# Altium schematic sheet IOT_4G_BOARD.SchDoc
size A3; SheetNumber: 1; SheetTotal: 9
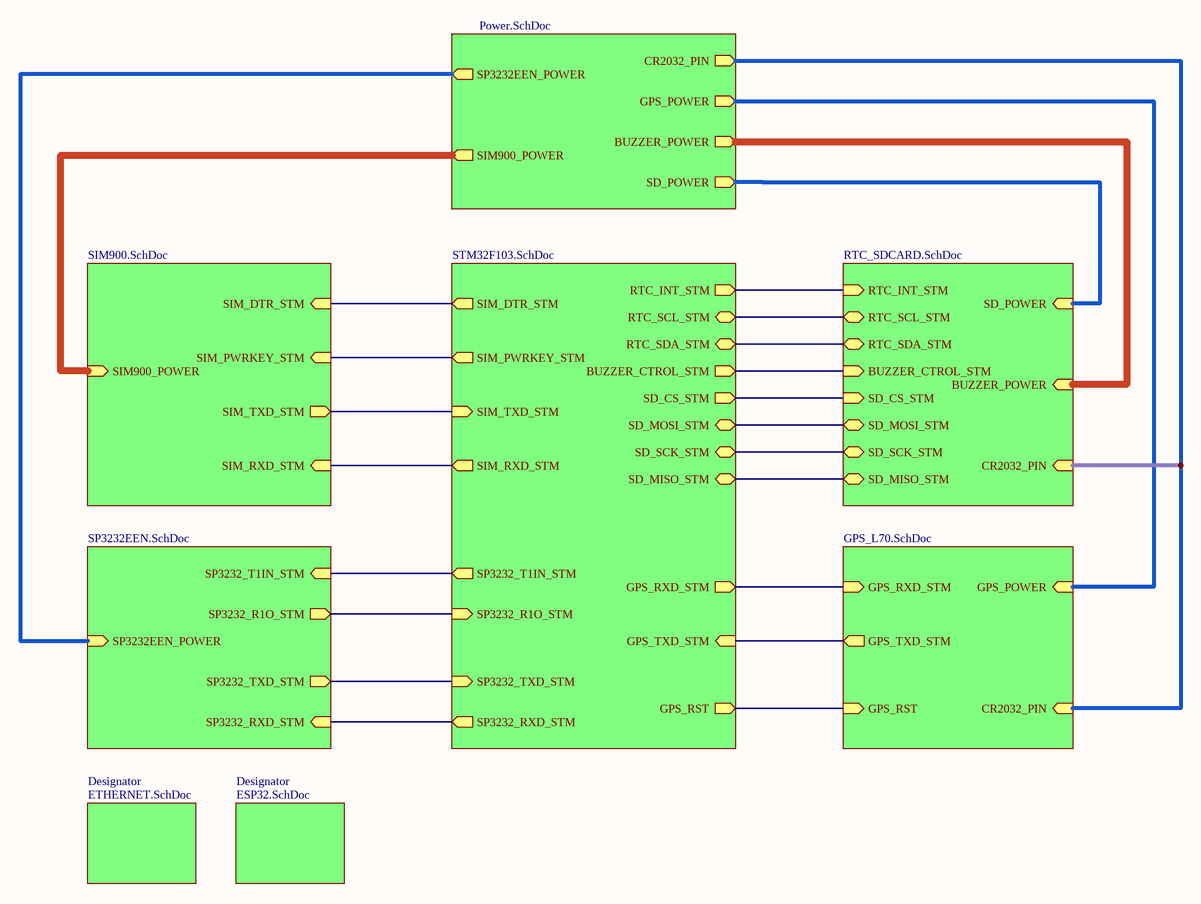
[diagram p0: IOT_4G_BOARD.SchDoc]

## Sub-sheets
Designator = SIM900.SchDoc: SIM900_POWER (in), SIM_RXD_STM (in), SIM_DTR_STM (in), SIM_TXD_STM (out), SIM_PWRKEY_STM (in)
Designator = SP3232EEN.SchDoc: SP3232EEN_POWER (in), SP3232_T1IN_STM (in), SP3232_R1O_STM (out), SP3232_TXD_STM (out), SP3232_RXD_STM (in)
Designator = STM32F103.SchDoc: SIM_RXD_STM (out), SIM_DTR_STM (out), SIM_TXD_STM (in), SP3232_T1IN_STM (out), SP3232_R1O_STM (in), SP3232_TXD_STM (in), SP3232_RXD_STM (out), RTC_SDA_STM (bidir), BUZZER_CTROL_STM (out), SD_CS_STM (out), SD_MOSI_STM (bidir), SD_SCK_STM (bidir), SD_MISO_STM (bidir), RTC_SCL_STM (bidir), RTC_INT_STM (out), GPS_RXD_STM (out), GPS_TXD_STM (in), GPS_RST (out), SIM_PWRKEY_STM (out)
Designator = RTC_SDCARD.SchDoc: CR2032_PIN (in), BUZZER_POWER (in), SD_POWER (in), RTC_SDA_STM (bidir), BUZZER_CTROL_STM (in), SD_CS_STM (in), SD_MOSI_STM (bidir), SD_SCK_STM (bidir), SD_MISO_STM (bidir), RTC_SCL_STM (bidir), RTC_INT_STM (in)
Designator = GPS_L70.SchDoc: GPS_POWER (in), CR2032_PIN (in), GPS_RXD_STM (in), GPS_TXD_STM (out), GPS_RST (in)
Designator = Power.SchDoc: CR2032_PIN (out), GPS_POWER (out), BUZZER_POWER (out), SD_POWER (out), SP3232EEN_POWER (out), SIM900_POWER (out)
Designator = ETHERNET.SchDoc: no entries
Designator = ESP32.SchDoc: no entries

## Nets
(unnamed): sheet Designator/SIM900_POWER, sheet Designator/SIM900_POWER
(unnamed): sheet Designator/SIM_RXD_STM, sheet Designator/SIM_RXD_STM
(unnamed): sheet Designator/SIM_DTR_STM, sheet Designator/SIM_DTR_STM
(unnamed): sheet Designator/SIM_TXD_STM, sheet Designator/SIM_TXD_STM
(unnamed): sheet Designator/SIM_PWRKEY_STM, sheet Designator/SIM_PWRKEY_STM
(unnamed): sheet Designator/SP3232EEN_POWER, sheet Designator/SP3232EEN_POWER
(unnamed): sheet Designator/SP3232_T1IN_STM, sheet Designator/SP3232_T1IN_STM
(unnamed): sheet Designator/SP3232_R1O_STM, sheet Designator/SP3232_R1O_STM
(unnamed): sheet Designator/SP3232_TXD_STM, sheet Designator/SP3232_TXD_STM
(unnamed): sheet Designator/SP3232_RXD_STM, sheet Designator/SP3232_RXD_STM
(unnamed): sheet Designator/RTC_SDA_STM, sheet Designator/RTC_SDA_STM
(unnamed): sheet Designator/BUZZER_CTROL_STM, sheet Designator/BUZZER_CTROL_STM
(unnamed): sheet Designator/SD_CS_STM, sheet Designator/SD_CS_STM
(unnamed): sheet Designator/SD_MOSI_STM, sheet Designator/SD_MOSI_STM
(unnamed): sheet Designator/SD_SCK_STM, sheet Designator/SD_SCK_STM
(unnamed): sheet Designator/SD_MISO_STM, sheet Designator/SD_MISO_STM
(unnamed): sheet Designator/RTC_SCL_STM, sheet Designator/RTC_SCL_STM
(unnamed): sheet Designator/RTC_INT_STM, sheet Designator/RTC_INT_STM
(unnamed): sheet Designator/GPS_RXD_STM, sheet Designator/GPS_RXD_STM
(unnamed): sheet Designator/GPS_TXD_STM, sheet Designator/GPS_TXD_STM
(unnamed): sheet Designator/GPS_RST, sheet Designator/GPS_RST
(unnamed): sheet Designator/CR2032_PIN, sheet Designator/CR2032_PIN, sheet Designator/CR2032_PIN
(unnamed): sheet Designator/BUZZER_POWER, sheet Designator/BUZZER_POWER
(unnamed): sheet Designator/SD_POWER, sheet Designator/SD_POWER
(unnamed): sheet Designator/GPS_POWER, sheet Designator/GPS_POWER